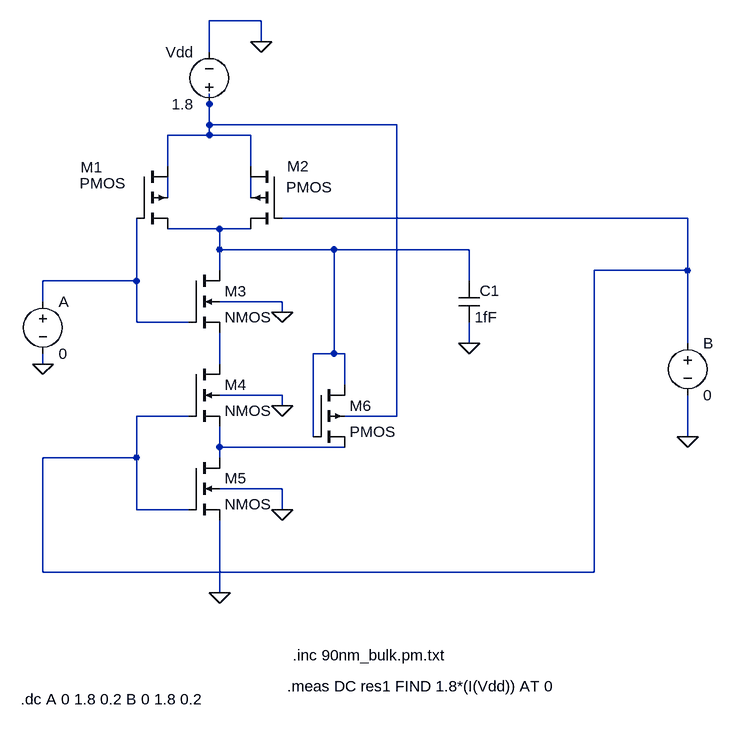
[diagram p0: schematic NAND.asc]
NAND.asc, the LTspice schematic file:
Version 4
SHEET 1 1316 1216
WIRE 320 -80 240 -80
WIRE 320 -48 320 -80
WIRE 240 -32 240 -80
WIRE 240 48 240 32
WIRE 240 80 240 48
WIRE 528 80 240 80
WIRE 240 96 240 80
WIRE 240 96 176 96
WIRE 304 96 240 96
WIRE 176 144 176 96
WIRE 304 144 304 96
WIRE 176 192 176 160
WIRE 304 192 304 160
WIRE 976 224 352 224
WIRE 256 240 176 240
WIRE 304 240 256 240
WIRE 256 272 256 240
WIRE 432 272 256 272
WIRE 640 272 432 272
WIRE 256 304 256 272
WIRE 976 304 976 224
WIRE 976 304 832 304
WIRE 128 320 128 224
WIRE 128 320 -16 320
WIRE 640 320 640 272
WIRE -16 352 -16 320
WIRE 352 352 256 352
WIRE 352 368 352 352
WIRE 128 384 128 320
WIRE 208 384 128 384
WIRE 640 416 640 384
WIRE 976 416 976 304
WIRE 432 432 432 272
WIRE 432 432 400 432
WIRE 448 432 432 432
WIRE -16 448 -16 432
WIRE 256 448 256 400
WIRE 448 480 448 432
WIRE 352 496 256 496
WIRE 352 512 352 496
WIRE 208 528 128 528
WIRE 528 528 528 80
WIRE 528 528 448 528
WIRE 400 560 400 432
WIRE 976 560 976 496
WIRE 256 576 256 544
WIRE 448 576 256 576
WIRE 128 592 128 528
WIRE 128 592 -16 592
WIRE 256 592 256 576
WIRE 352 640 256 640
WIRE 128 672 128 592
WIRE 208 672 128 672
WIRE 352 672 352 640
WIRE -16 768 -16 592
WIRE 832 768 832 304
WIRE 832 768 -16 768
WIRE 256 800 256 688
FLAG 352 368 0
FLAG 256 800 0
FLAG 352 512 0
FLAG 352 672 0
FLAG 320 -48 0
FLAG -16 448 0
FLAG 976 560 0
FLAG 640 416 0
SYMBOL pmos4 128 144 R0
WINDOW 0 -86 1 Left 2
WINDOW 3 -87 26 Left 2
SYMATTR InstName M1
SYMATTR Value2 l=100n w=320n
SYMBOL pmos4 352 144 M0
WINDOW 0 -42 0 Left 2
WINDOW 3 -77 32 Left 2
SYMATTR InstName M2
SYMATTR Value2 l=100n w=320n
SYMBOL nmos4 208 304 R0
SYMATTR InstName M3
SYMATTR Value2 l=100n w=120n
SYMBOL nmos4 208 448 R0
SYMATTR InstName M4
SYMATTR Value2 l=100n w=120n
SYMBOL nmos4 208 592 R0
SYMATTR InstName M5
SYMATTR Value2 l=100n w=120n
SYMBOL pmos4 400 480 R0
SYMATTR InstName M6
SYMATTR Value2 l=100n w=320n
SYMBOL cap 624 320 R0
WINDOW 0 32 15 Left 2
SYMATTR InstName C1
SYMATTR Value 1fF
SYMBOL voltage 240 64 R180
WINDOW 0 24 96 Left 2
WINDOW 3 24 16 Left 2
WINDOW 123 0 0 Left 0
WINDOW 39 0 0 Left 0
SYMATTR InstName Vdd
SYMATTR Value 1.8
SYMBOL voltage -16 336 R0
WINDOW 123 0 0 Left 0
WINDOW 39 0 0 Left 0
SYMATTR InstName A
SYMATTR Value 0
SYMBOL voltage 976 400 R0
WINDOW 123 0 0 Left 0
WINDOW 39 0 0 Left 0
SYMATTR InstName B
SYMATTR Value 0
TEXT 360 944 Left 2 !.meas DC res1 FIND 1.8*(I(Vdd)) AT 0
TEXT 368 896 Left 2 !.inc 90nm_bulk.pm.txt
TEXT -50 964 Left 2 !.dc A 0 1.8 0.2 B 0 1.8 0.2

The netlist it stands for:
* NAND.asc
M1 N001 N006 N005 N002 PMOS l=100n w=320n
M2 N001 N004 N005 N003 PMOS l=100n w=320n
M3 N005 N006 N007 0 NMOS l=100n w=120n
M4 N007 N004 N008 0 NMOS l=100n w=120n
M5 N008 N004 0 0 NMOS l=100n w=120n
M6 N005 N005 N008 N001 PMOS l=100n w=320n
C1 N005 0 1fF
Vdd N001 0 1.8
V§A N006 0 0
V§B N004 0 0
.model NMOS NMOS
.model PMOS PMOS
.lib standard.mos
.meas DC res1 FIND 1.8*(I(Vdd)) AT 0
.inc 90nm_bulk.pm.txt
.dc A 0 1.8 0.2 B 0 1.8 0.2
.backanno
.end